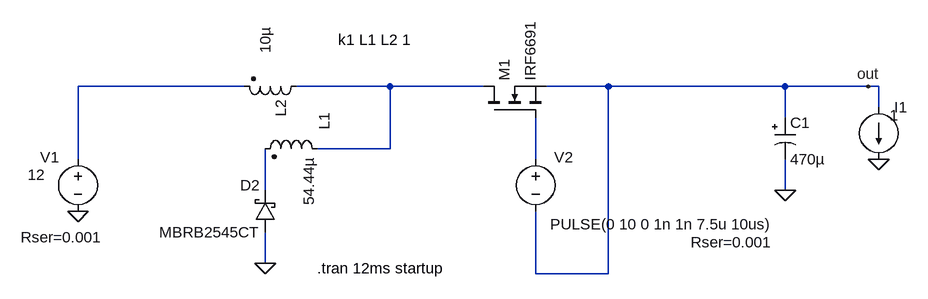
[diagram p0: schematic Input Inductor Buck.asc]
Input Inductor Buck.asc, the LTspice schematic file:
Version 4
SHEET 1 2136 680
WIRE -288 -336 -544 -336
WIRE -64 -336 -208 -336
WIRE 80 -336 -64 -336
WIRE 272 -336 176 -336
WIRE 544 -336 272 -336
WIRE 672 -336 544 -336
WIRE 688 -336 672 -336
WIRE 688 -304 688 -336
WIRE 544 -288 544 -336
WIRE -64 -240 -64 -336
WIRE -64 -240 -176 -240
WIRE -544 -224 -544 -336
WIRE 160 -224 160 -288
WIRE -256 -176 -256 -240
WIRE 544 -176 544 -224
WIRE -256 -64 -256 -112
WIRE 160 -48 160 -144
WIRE 272 -48 272 -336
WIRE 272 -48 160 -48
FLAG 544 -176 0
FLAG -544 -144 0
FLAG 688 -224 0
FLAG 672 -336 out
FLAG -256 -64 0
SYMBOL load2 688 -304 R0
WINDOW 123 0 0 Left 0
WINDOW 39 0 0 Left 0
WINDOW 3 17 12 Left 0
SYMATTR Value 1
SYMATTR InstName I1
SYMBOL voltage -544 -240 R0
WINDOW 3 -77 40 Left 0
WINDOW 123 0 0 Left 0
WINDOW 39 -88 136 Left 0
WINDOW 0 -58 13 Left 0
SYMATTR Value 12
SYMATTR SpiceLine Rser=0.001
SYMATTR InstName V1
SYMBOL ind2 -192 -352 R90
WINDOW 3 -75 64 Left 0
SYMATTR Value 10µ
SYMATTR InstName L2
SYMATTR SpiceLine Rser=.001
SYMBOL ind2 -160 -224 M270
WINDOW 0 45 5 Left 0
WINDOW 3 -71 29 Left 0
SYMATTR InstName L1
SYMATTR Value 54.44µ
SYMATTR SpiceLine Rser=0.001
SYMBOL schottky -240 -112 R180
WINDOW 0 24 72 Left 0
WINDOW 3 24 0 Left 0
SYMATTR InstName D2
SYMATTR Value MBRB2545CT
SYMATTR Description Diode
SYMATTR Type diode
SYMBOL voltage 160 -240 M0
WINDOW 3 -365 116 Left 0
WINDOW 123 0 0 Left 0
WINDOW 39 -365 144 Left 0
WINDOW 0 -58 13 Left 0
SYMATTR Value PULSE(0 10 0 1n 1n 7.5u 10us)
SYMATTR SpiceLine Rser=0.001
SYMATTR InstName V2
SYMBOL nmos 80 -288 R270
SYMATTR InstName M1
SYMATTR Value IRF6691
SYMBOL polcap 528 -288 R0
WINDOW 3 24 64 Left 0
SYMATTR Value 470µ
SYMATTR InstName C1
SYMATTR Description Capacitor
SYMATTR Type cap
SYMATTR SpiceLine V=63 Rser=0.001 MTBF=1000 Lser=0 ppPkg=1
TEXT -176 -56 Left 0 !.tran 12ms startup
TEXT -144 -408 Left 0 !k1 L1 L2 1

The netlist it stands for:
* Input Inductor Buck.asc
I1 out 0 1
V1 N001 0 12 Rser=0.001
L2 N002 N001 10µ Rser=.001
L1 N002 N004 54.44µ Rser=0.001
D2 0 N004 MBRB2545CT
V2 N003 out PULSE(0 10 0 1n 1n 7.5u 10us) Rser=0.001
M1 N002 N003 out out IRF6691
C1 out 0 470µ V=63 Rser=0.001 MTBF=1000 Lser=0 ppPkg=1
.model D D
.lib standard.dio
.model NMOS NMOS
.model PMOS PMOS
.lib standard.mos
.tran 12ms startup
k1 L1 L2 1
.backanno
.end